# Altium schematic sheet RLC.SchDoc: <Document>
size Letter; Engineer: <Engineer>; Organization: UPEL; Address1: USU Power Electronics Lab; Address2: USTAR Building 620, RM 118; Address3: 1600 N 620 E; Address4: North Logan, UT 84341; DocumentNumber: 4; Revision: v1; SheetNumber: 4; SheetTotal: 16; ProjectName: <Project>
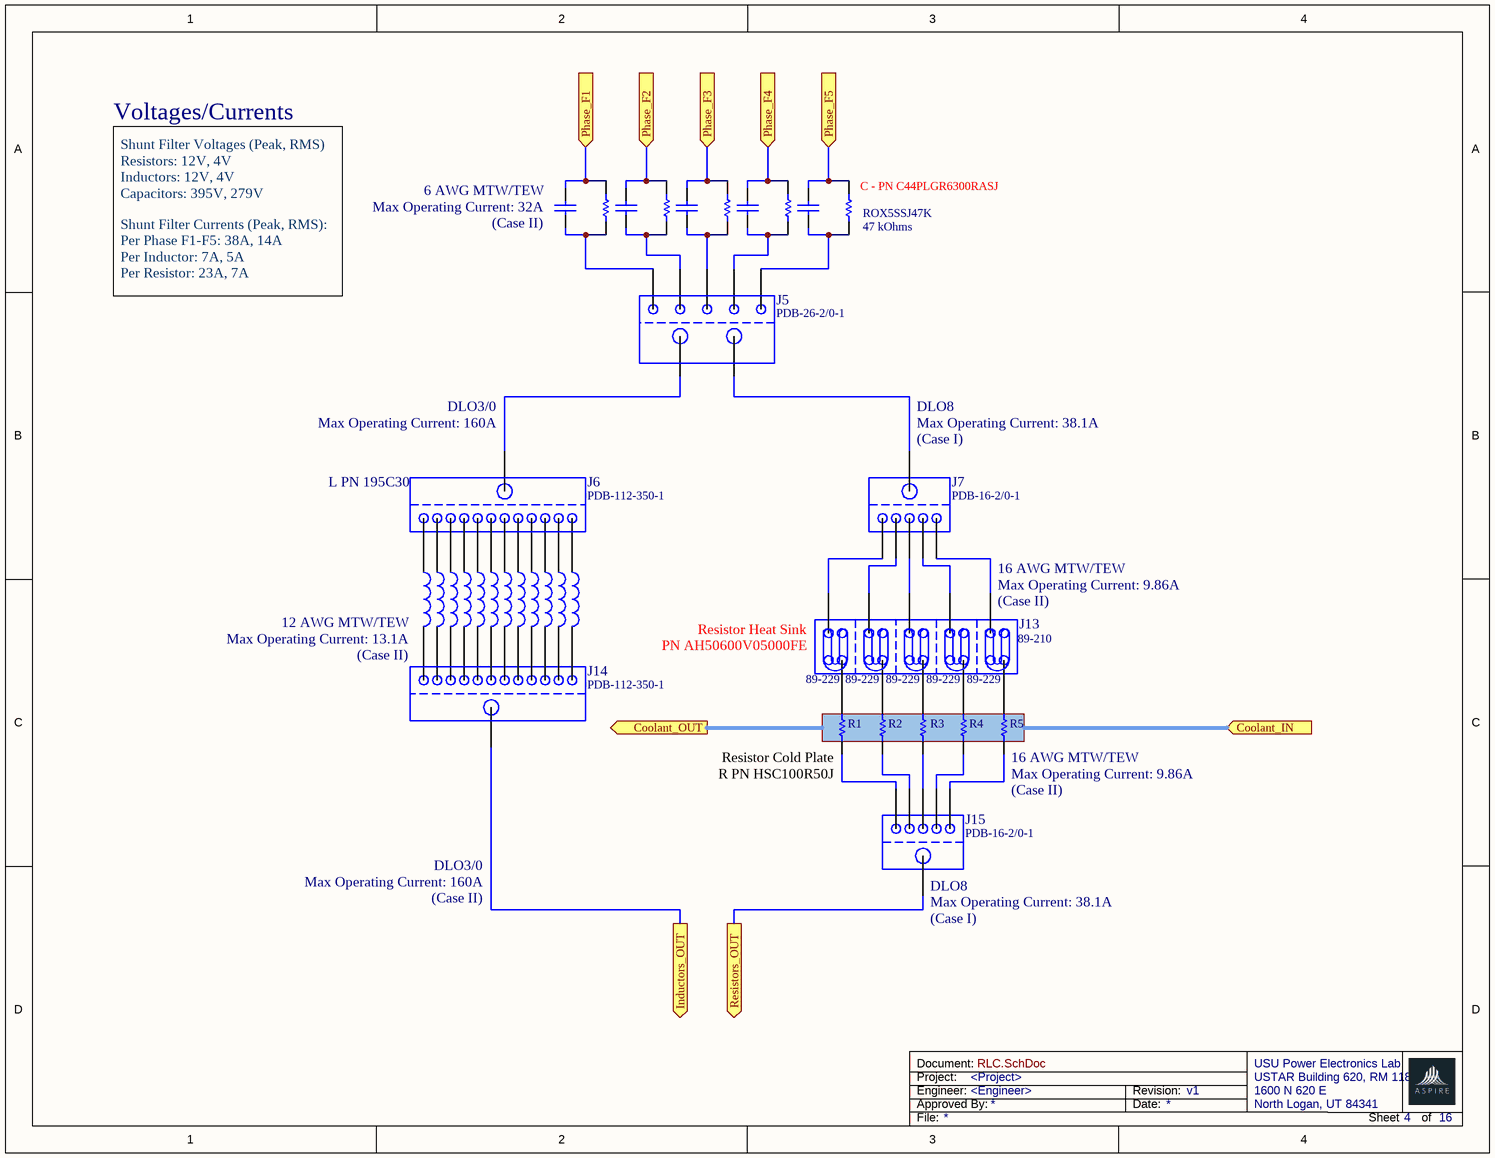
[diagram p0: RLC.SchDoc]

## Parts
(Parts that share a designator on the sheet are numbered #1, #2 ... from top to bottom, then left to right.)
C1  Cap  [RAD-0.3]  (value not drawn)
C2  Cap  [RAD-0.3]  (value not drawn)
C3  Cap  [RAD-0.3]  (value not drawn)
C4  Cap  [RAD-0.3]  (value not drawn)
C5  Cap  [RAD-0.3]  (value not drawn)
J5  PDB-26-2/0-1
J6  PDB-112-350-1
J7  PDB-16-2/0-1
J8  89-229
J9  89-229
J10  89-229
J11  89-229
J12  89-229
J13  89-210
J14  PDB-112-350-1
J15  PDB-16-2/0-1
L3  Inductor  [0402-A]  (value not drawn)
L4  Inductor  [0402-A]  (value not drawn)
L5  Inductor  [0402-A]  (value not drawn)
L6  Inductor  [0402-A]  (value not drawn)
L7  Inductor  [0402-A]  (value not drawn)
L8  Inductor  [0402-A]  (value not drawn)
L9  Inductor  [0402-A]  (value not drawn)
L10  Inductor  [0402-A]  (value not drawn)
L11  Inductor  [0402-A]  (value not drawn)
L12  Inductor  [0402-A]  (value not drawn)
L13  Inductor  [0402-A]  (value not drawn)
L14  Inductor  [0402-A]  (value not drawn)
R1  {Rsh}  [AXIAL-0.3]  (value not drawn)
R2  {Rsh}  [AXIAL-0.3]  (value not drawn)
R3  {Rsh}  [AXIAL-0.3]  (value not drawn)
R4  {Rsh}  [AXIAL-0.3]  (value not drawn)
R5  {Rsh}  [AXIAL-0.3]  (value not drawn)
ROX5SSJ47K  47 kOhms
ROX?#1  47 kOhms  (value not drawn)
ROX?#2  47 kOhms  (value not drawn)
ROX?#3  47 kOhms  (value not drawn)
ROX?#4  47 kOhms  (value not drawn)

## Ports
Coolant_IN (in), Coolant_OUT (out), Inductors_OUT (out), Phase_F1 (in), Phase_F2 (in), Phase_F3 (in), Phase_F4 (in), Phase_F5 (in), Resistors_OUT (out)

## Nets
Inductors_OUT: J14.0 ; port Inductors_OUT
Phase_F1: C1.2 ROX?#1.2 ; port Phase_F1
Phase_F2: C2.2 ROX?#2.2 ; port Phase_F2
Phase_F3: C3.2 ROX?#3.2 ; port Phase_F3
Phase_F4: C4.2 ROX?#4.2 ; port Phase_F4
Phase_F5: C5.2 ROX5SSJ47K.2 ; port Phase_F5
Resistors_OUT: J15.0 ; port Resistors_OUT
NetC1_1: C1.1 J5.5 ROX?#1.1
NetC2_1: C2.1 J5.4 ROX?#2.1
NetC3_1: C3.1 J5.3 ROX?#3.1
NetC4_1: C4.1 J5.2 ROX?#4.1
NetC5_1: C5.1 J5.1 ROX5SSJ47K.1
NetJ5_0: J5.0 J6.0
NetJ5_0: J5.0 J7.0  [a separate net that carries the same name]
NetJ6_1: J6.1 L3.1
NetJ6_1: J6.1 L5.1  [a separate net that carries the same name]
NetJ6_1: J6.1 L14.1  [a separate net that carries the same name]
NetJ6_2: J6.2 L4.1
NetJ6_2: J6.2 L6.1  [a separate net that carries the same name]
NetJ6_2: J6.2 L13.1  [a separate net that carries the same name]
NetJ6_3: J6.3 L7.1
NetJ6_3: J6.3 L10.1  [a separate net that carries the same name]
NetJ6_4: J6.4 L8.1
NetJ6_4: J6.4 L11.1  [a separate net that carries the same name]
NetJ6_5: J6.5 L9.1
NetJ6_5: J6.5 L12.1  [a separate net that carries the same name]
NetJ7_1: J7.1 J13.6
NetJ7_2: J7.2 J13.7
NetJ7_3: J7.3 J13.8
NetJ7_4: J7.4 J13.9
NetJ7_5: J7.5 J13.10
NetJ13_11: J13.11 R1.2
NetJ13_12: J13.12 R2.2
NetJ13_13: J13.13 R3.2
NetJ13_14: J13.14 R4.2
NetJ13_15: J13.15 R5.2
NetJ14_1: J14.1 L7.2
NetJ14_1: J14.1 L10.2  [a separate net that carries the same name]
NetJ14_1: J14.1 L12.2  [a separate net that carries the same name]
NetJ14_2: J14.2 L6.2
NetJ14_2: J14.2 L11.2  [a separate net that carries the same name]
NetJ14_2: J14.2 L13.2  [a separate net that carries the same name]
NetJ14_3: J14.3 L5.2
NetJ14_3: J14.3 L14.2  [a separate net that carries the same name]
NetJ14_4: J14.4 L4.2
NetJ14_4: J14.4 L9.2  [a separate net that carries the same name]
NetJ14_5: J14.5 L3.2
NetJ14_5: J14.5 L8.2  [a separate net that carries the same name]
NetJ15_1: J15.1 R5.1
NetJ15_2: J15.2 R4.1
NetJ15_3: J15.3 R3.1
NetJ15_4: J15.4 R2.1
NetJ15_5: J15.5 R1.1

## Notes on the sheet
- Voltages/Currents
- Shunt Filter Voltages (Peak, RMS)
  Resistors: 12V, 4V
  Inductors: 12V, 4V
  Capacitors: 395V, 279V
- (near C1) 6 AWG MTW/TEW
  Max Operating Current: 32A
  (Case II)
- (near ROX5SSJ47K) C - PN C44PLGR6300RASJ
- Shunt Filter Currents (Peak, RMS):
  Per Phase F1-F5: 38A, 14A
  Per Inductor: 7A, 5A
  Per Resistor: 23A, 7A
- DLO3/0
  Max Operating Current: 160A
- (near J6) L PN 195C30
- (near J7) DLO8
  Max Operating Current: 38.1A
  (Case I)
- 16 AWG MTW/TEW
  Max Operating Current: 9.86A
  (Case II)
- 12 AWG MTW/TEW
  Max Operating Current: 13.1A
  (Case II)
- (near J13) Resistor Heat Sink
  PN AH50600V05000FE
- (near R1) Resistor Cold Plate
  R PN HSC100R50J
- (near R5) 16 AWG MTW/TEW
  Max Operating Current: 9.86A
  (Case II)
- DLO3/0
  Max Operating Current: 160A
  (Case II)
- (near J15) DLO8
  Max Operating Current: 38.1A
  (Case I)
- Project:
- Engineer:
- Document:
- Approved By:
- Date:
- Revision:
- File:
- Sheet
- of

## Library data of the parts
C1-C5 = Cap: Capacitor; Value: {Csh}; Published: 8-Jun-2000; LatestRevisionDate: 17-Jul-2002; LatestRevisionNote: Re-released for DXP Platform.; PackageReference: RAD-0.3; Publisher: Altium Limited; PackageDescription: Radial Cap, Thru-Hole; 2 Leads; 0.3 in Pin Spacing
L3-L14 = Inductor: Code_IEC: 1005; Value: {Lsh}; Published: 8-Jun-2000; LatestRevisionDate: 29-May-2009; LatestRevisionNote: IPC-7351 Footprint Added.; PackageReference: 0402-A; Publisher: Altium Limited; PackageDescription: Chip Inductor; Code_JEITA: 0402
R1-R5 = Res1: Resistor; Value: 1K; Published: 8-Jun-2000; LatestRevisionDate: 17-Jul-2002; LatestRevisionNote: Re-released for DXP Platform.; PackageReference: AXIAL-0.3; Publisher: Altium Limited; PackageDescription: Axial Device, Thru-Hole; 2 Leads; 0.3 in Pin Spacing
ROX5SSJ47K ROX?#1-ROX?#4 = Resistor: TC1: 0; SimulationGenericComponent: True; Value: 1K; TC2: 0